# EAGLE design Yombonet (EAGLE 7.1.0)
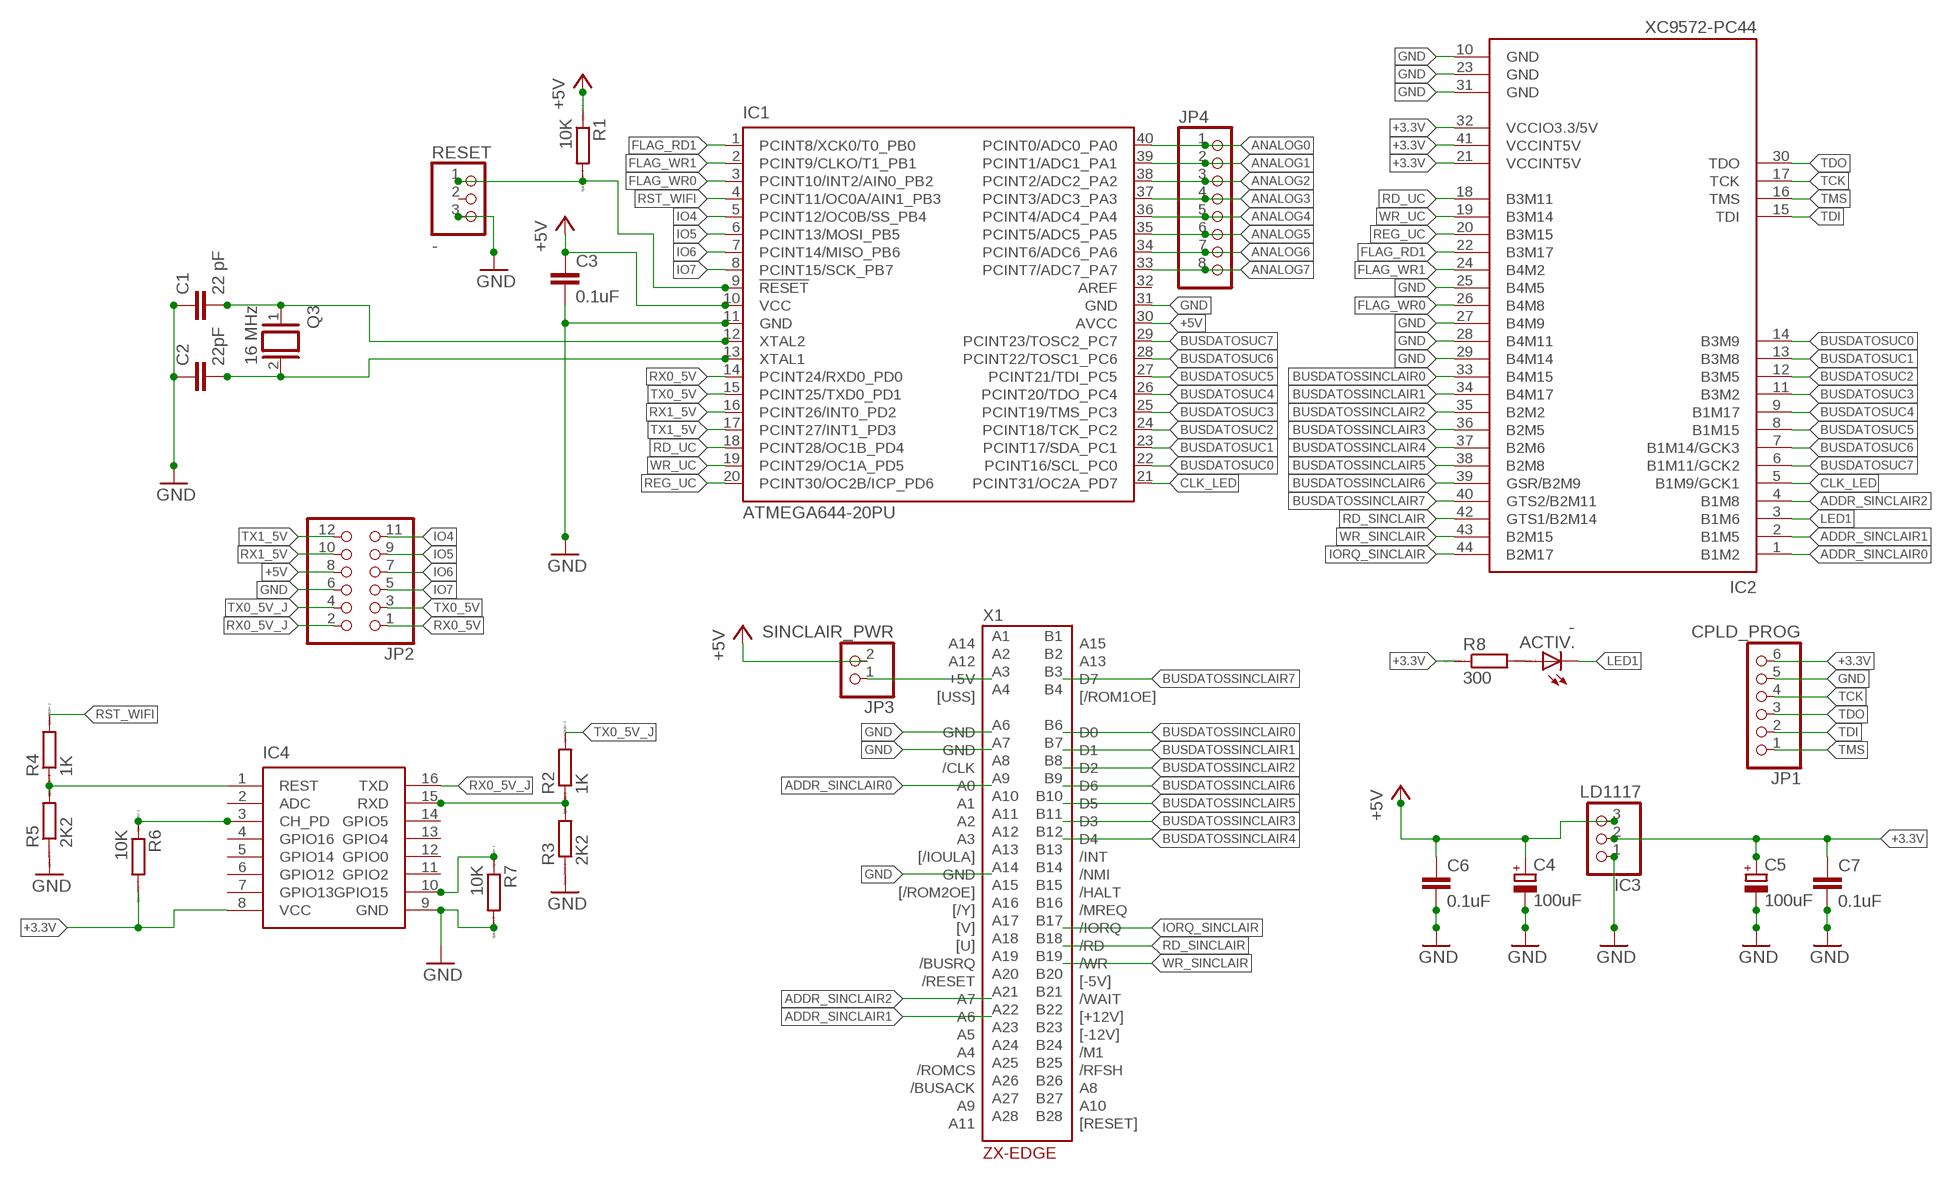
[diagram p0: schematic, sheet 1]

## Parts
ACTIV.  -  LED3MM  [LED3MM]
C1  22 pF  C-EU025-024X044  [C025-024X044]
C2  22pF  C-EU025-024X044  [C025-024X044]
C3  0.1uF  C-EU025-025X050  [C025-025X050]
C4  100uF  CPOL-EUE2.5-7  [E2,5-7]
C5  100uF  CPOL-EUE2.5-7  [E2,5-7]
C6  0.1uF  C-EU025-025X050  [C025-025X050]
C7  0.1uF  C-EU025-025X050  [C025-025X050]
IC1  ATMEGA644-20PU  [DIL40]
IC2  XC9572-PC44  [PLCC-S44]
IC3  LD1117  PINHD-1X3  [1X03]
IC4  ESP-07ESP-07  [ESP-07]
JP1  CPLD_PROG  PINHD-1X6  [1X06]
JP2  PINHD-2X6  [2X06]
JP3  SINCLAIR_PWR  PINHD-1X2  [1X02]
JP4  PINHD-1X8  [1X08]
Q3  16 MHz  XTAL/S  [QS]
R1  10K  R-EU_0207_10  [0207/10]
R2  1K  R-EU_0207_10  [0207/10]
R3  2K2  R-EU_0207_10  [0207/10]
R4  1K  R-EU_0207_10  [0207/10]
R5  2K2  R-EU_0207_10  [0207/10]
R6  10K  R-EU_0207_10  [0207/10]
R7  10K  R-EU_0207_10  [0207/10]
R8  300  R-EU_0207_10  [0207/10]
RESET  -  PINHD-1X3  [1X03]
X1  ZX-EDGE  [ZX-IFACE]

## Nets
+3.3V [power]: C5.+ C7.1 IC2.21(VCCINT5V) IC2.32(VCCIO3.3/5V) IC2.41(VCCINT5V) IC3.2 IC4.8(VCC) JP1.6 R6.2 R8.1
+5V [power]: C3.1 C4.+ C6.1 IC1.10(VCC) IC1.30(AVCC) IC3.3 JP2.8 JP3.2 R1.1
ADDR_SINCLAIR0: IC2.1(B1M2) X1.A9(A0)
ADDR_SINCLAIR1: IC2.2(B1M5) X1.A22(A6)
ADDR_SINCLAIR2: IC2.4(B1M8) X1.A21(A7)
ANALOG0: IC1.40(PCINT0/ADC0_PA0) JP4.1
ANALOG1: IC1.39(PCINT1/ADC1_PA1) JP4.2
ANALOG2: IC1.38(PCINT2/ADC2_PA2) JP4.3
ANALOG3: IC1.37(PCINT3/ADC3_PA3) JP4.4
ANALOG4: IC1.36(PCINT4/ADC4_PA4) JP4.5
ANALOG5: IC1.35(PCINT5/ADC5_PA5) JP4.6
ANALOG6: IC1.34(PCINT6/ADC6_PA6) JP4.7
ANALOG7: IC1.33(PCINT7/ADC7_PA7) JP4.8
BUSDATOSSINCLAIR0: IC2.33(B4M15) X1.B6(D0)
BUSDATOSSINCLAIR1: IC2.34(B4M17) X1.B7(D1)
BUSDATOSSINCLAIR2: IC2.35(B2M2) X1.B8(D2)
BUSDATOSSINCLAIR3: IC2.36(B2M5) X1.B11(D3)
BUSDATOSSINCLAIR4: IC2.37(B2M6) X1.B12(D4)
BUSDATOSSINCLAIR5: IC2.38(B2M8) X1.B10(D5)
BUSDATOSSINCLAIR6: IC2.39(GSR/B2M9) X1.B9(D6)
BUSDATOSSINCLAIR7: IC2.40(GTS2/B2M11) X1.B3(D7)
BUSDATOSUC0: IC1.22(PCINT16/SCL_PC0) IC2.14(B3M9)
BUSDATOSUC1: IC1.23(PCINT17/SDA_PC1) IC2.13(B3M8)
BUSDATOSUC2: IC1.24(PCINT18/TCK_PC2) IC2.12(B3M5)
BUSDATOSUC3: IC1.25(PCINT19/TMS_PC3) IC2.11(B3M2)
BUSDATOSUC4: IC1.26(PCINT20/TDO_PC4) IC2.9(B1M17)
BUSDATOSUC5: IC1.27(PCINT21/TDI_PC5) IC2.8(B1M15)
BUSDATOSUC6: IC1.28(PCINT22/TOSC1_PC6) IC2.7(B1M14/GCK3)
BUSDATOSUC7: IC1.29(PCINT23/TOSC2_PC7) IC2.6(B1M11/GCK2)
CH_PH_PULLUP: IC4.3(CH_PD) R6.1
CLK_LED: IC1.21(PCINT31/OC2A_PD7) IC2.5(B1M9/GCK1)
FLAG_RD1: IC1.1(PCINT8/XCK0/T0_PB0) IC2.22(B3M17)
FLAG_WR0: IC1.3(PCINT10/INT2/AIN0_PB2) IC2.26(B4M8)
FLAG_WR1: IC1.2(PCINT9/CLKO/T1_PB1) IC2.24(B4M2)
GND [ground]: C1.1 C2.1 C3.2 C4.- C5.- C6.2 C7.2 IC1.11(GND) IC1.31(GND) IC2.10(GND) IC2.23(GND) IC2.25(B4M5) IC2.27(B4M9) IC2.28(B4M11) IC2.29(B4M14) IC2.31(GND) IC3.1 IC4.9(GND) JP1.5 JP2.6 R3.1 R5.1 R7.2 RESET.3 X1.A6(GND) X1.A7(GND) X1.A14(GND)
GPIO15_PULLDOWN: IC4.10(GPIO15) R7.1
IO4: IC1.5(PCINT12/OC0B/SS_PB4) JP2.11
IO5: IC1.6(PCINT13/MOSI_PB5) JP2.9
IO6: IC1.7(PCINT14/MISO_PB6) JP2.7
IO7: IC1.8(PCINT15/SCK_PB7) JP2.5
IORQ_SINCLAIR: IC2.44(B2M17) X1.B17(/IORQ)
LED1: ACTIV..K(C) IC2.3(B1M6)
N$1: IC4.15(RXD) R2.1 R3.2
N$2 [ground]: ACTIV..A R8.2
N$3 [power]: JP3.1 X1.A3(+5V)
OSC1: C1.2 IC1.12(XTAL2) Q3.1
OSC2: C2.2 IC1.13(XTAL1) Q3.2
RD_SINCLAIR: IC2.42(GTS1/B2M14) X1.B18(/RD)
RD_UC: IC1.18(PCINT28/OC1B_PD4) IC2.18(B3M11)
REG_UC: IC1.20(PCINT30/OC2B/ICP_PD6) IC2.20(B3M15)
RESET_UC: IC1.9(!RESET) R1.2 RESET.1
RST_WIFI: IC1.4(PCINT11/OC0A/AIN1_PB3) R4.2
RST_WIFI_3.3V: IC4.1(REST) R4.1 R5.2
RX0_5V: IC1.14(PCINT24/RXD0_PD0) JP2.1
RX0_5V_J: IC4.16(TXD) JP2.2
RX1_5V: IC1.16(PCINT26/INT0_PD2) JP2.10
TCK: IC2.17(TCK) JP1.4
TDI: IC2.15(TDI) JP1.2
TDO: IC2.30(TDO) JP1.3
TMS: IC2.16(TMS) JP1.1
TX0_5V: IC1.15(PCINT25/TXD0_PD1) JP2.3
TX0_5V_J: JP2.4 R2.2
TX1_5V: IC1.17(PCINT27/INT1_PD3) JP2.12
WR_SINCLAIR: IC2.43(B2M15) X1.B19(/WR)
WR_UC: IC1.19(PCINT29/OC1A_PD5) IC2.19(B3M14)
Unconnected: IC1.32(AREF) IC4.2(ADC) IC4.4(GPIO16) IC4.5(GPIO14) IC4.6(GPIO12) IC4.7(GPIO13) IC4.11(GPIO2) IC4.12(GPIO0) IC4.13(GPIO4) IC4.14(GPIO5) RESET.2 X1.A1(A14) X1.A2(A12) X1.A4([USS]) X1.A8(/CLK) X1.A10(A1) X1.A11(A2) X1.A12(A3) X1.A13([/IOULA]) X1.A15([/ROM2OE]) X1.A16([/Y]) X1.A17([V]) X1.A18([U]) X1.A19(/BUSRQ) X1.A20(/RESET) X1.A23(A5) X1.A24(A4) X1.A25(/ROMCS) X1.A26(/BUSACK) X1.A27(A9) X1.A28(A11) X1.B1(A15) X1.B2(A13) X1.B4([/ROM1OE]) X1.B13(/INT) X1.B14(/NMI) X1.B15(/HALT) X1.B16(/MREQ) X1.B20([-5V]) X1.B21(/WAIT) X1.B22([+12V]) X1.B23([-12V]) X1.B24(/M1) X1.B25(/RFSH) X1.B26(A8) X1.B27(A10) X1.B28([RESET])

## Library data of the parts
ACTIV. = led:LED: LED OSRAM: - CHIPLED LG R971, LG N971, LY N971, LG Q971, LY Q971, LO R971, LY R971 LH N974, LH R974 LS Q976, LO Q976, LY Q976 LO Q996 - Hyper CHIPLED LW Q18S LB Q993, LB Q99A, LB R99A - SideLED LS A670, LO A670, LY A670, LG A670, LP A670 LB A673, LV A673, LT A673, LW A673 LH A674 LY A675 LS A676, LA A676, LO A676, LY A676, LW A676 LS A679, LY A679, LG A679 - Hyper Micro SIDELED� LS Y876, LA Y876, LO Y876, LY Y876 LT Y87S - SmartLED LW L88C, LW L88S LB L89C, LB L89S, LG L890 LS L89K, LO L89K, LY L89K LS L896, LA L896, LO L896, LY L896 - TOPLED LS T670, LO T670, LY T670, LG T670, LP T670 LSG T670, LSP T670, LSY T670, LOP T670, LYG T670 LG T671, LOG T671, LSG T671 LB T673, LV T673, LT T673, LW T673 LH T674 LS T676, LA T676, LO T676, LY T676, LB T676, LH T676, LSB T676, LW T676 LB T67C, LV T67C, LT T67C, LS T67K, LO T67K, LY T67K, LW E67C LS E67B, LA E67B, LO E67B, LY E67B, LB E67C, LV E67C, LT E67C LW T67C LS T679, LY T679, LG T679 LS T770, LO T770, LY T770, LG T770, LP T770 LB T773, LV T773, LT T773, LW T773 LH T774 LS E675, LA E675, LY E675, LS T675 LS T776, LA T776, LO T776, LY T776, LB T776 LHGB T686 LT T68C, LB T68C - Hyper Mini TOPLED� LB M676 - Mini TOPLED Santana� LG M470 LS M47K, LO M47K, LY M47K Source: http://www.osram.convergy.de LUXEON: - LUMILED� LXK2-PW12-R00, LXK2-PW12-S00, LXK2-PW14-U00, LXK2-PW14-V00 LXK2-PM12-R00, LXK2-PM12-S00, LXK2-PM14-U00 LXK2-PE12-Q00, LXK2-PE12-R00, LXK2-PE12-S00, LXK2-PE14-T00, LXK2-PE14-U00 LXK2-PB12-K00, LXK2-PB12-L00, LXK2-PB12-M00, LXK2-PB14-N00, LXK2-PB14-P00, LXK2-PB14-Q00 LXK2-PR12-L00, LXK2-PR12-M00, LXK2-PR14-Q00, LXK2-PR14-R00 LXK2-PD12-Q00, LXK2-PD12-R00, LXK2-PD12-S00 LXK2-PH12-R00, LXK2-PH12-S00 LXK2-PL12-P00, LXK2-PL12-Q00, LXK2-PL12-R00 Source: www.luxeon.com KINGBRIGHT: KA-3528ASYC Source: www.kingbright.com
C1-C3 C6 C7 = rcl:C-EU: CAPACITOR, European symbol
C4 C5 = rcl:CPOL-EU: POLARIZED CAPACITOR, European symbol
IC1 = atmel:ATMEGA644-*PU: 8-bit Microcontroller with 64K Bytes In-System Programmable Flash Auto generated by make-symbol-device-package-bsdl.ulp Rev. 34 Source: http://www.atmel.com/dyn/resources/prod_documents/doc2593.pdf; MPN: ATMEGA644-20PU; OC_FARNELL: 1288340; OC_NEWARK: 23M5060
IC2 = eOscope:XC9572-PC44
IC3 RESET = pinhead:PINHD-1X3: PIN HEADER
IC4 = Esp-07:ESP-07: Esp-07 ESP8266 WiFi module
JP1 = pinhead:PINHD-1X6: PIN HEADER
JP2 = pinhead:PINHD-2X6: PIN HEADER
JP3 = pinhead:PINHD-1X2: PIN HEADER
JP4 = pinhead:PINHD-1X8: PIN HEADER
Q3 = special:XTAL/S: CRYSTAL
R1-R8 = resistor:R-EU_: RESISTOR, European symbol; SPICEPREFIX: R
X1 = yabus:ZX-EDGE: Opposite part for ZX-Spectrum system bus

## Net classes
0 default: width 0.203 mm
1 ground: width 0.254 mm
2 power: width 0.406 mm

## Board
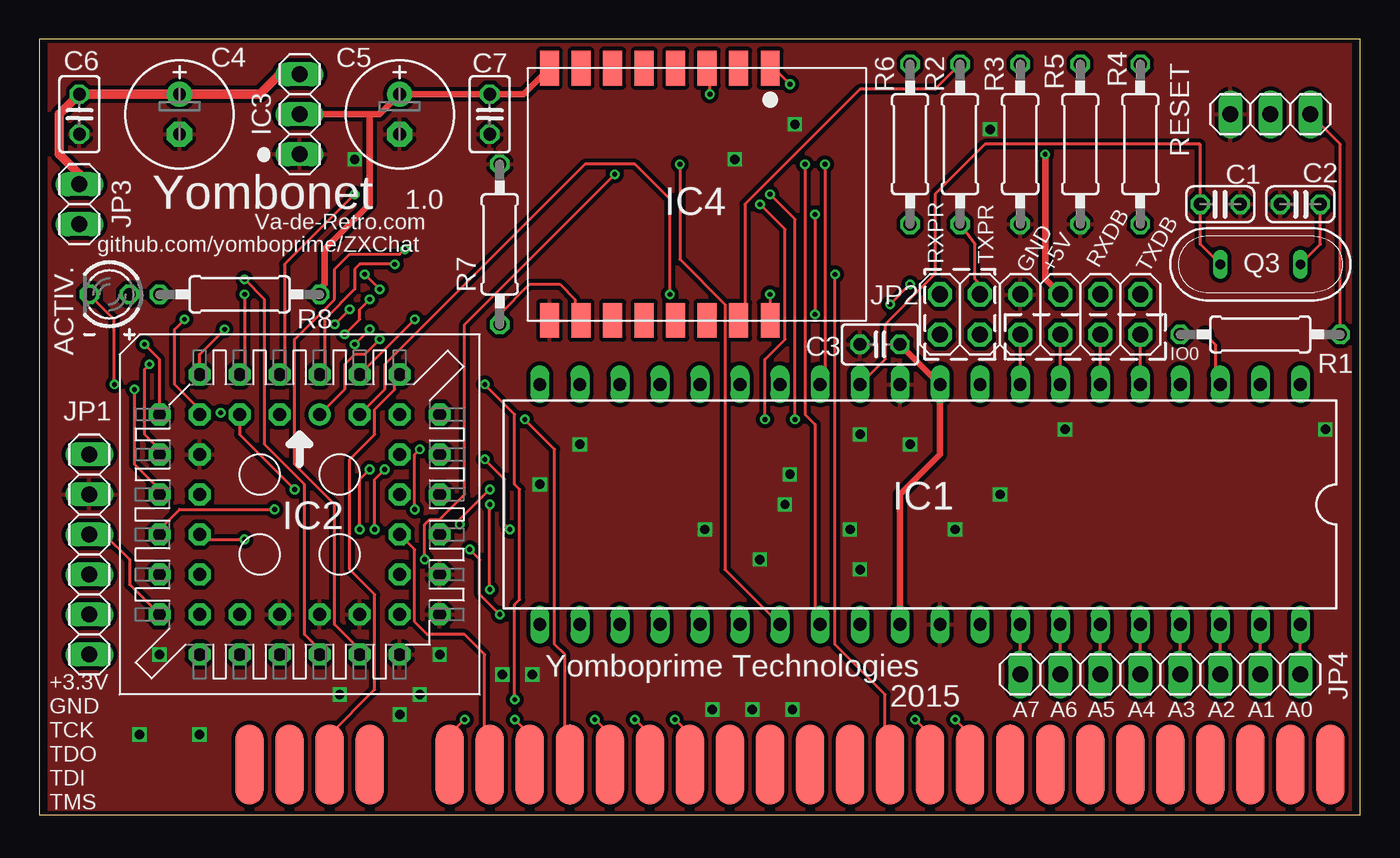
[diagram p1: board, top side]
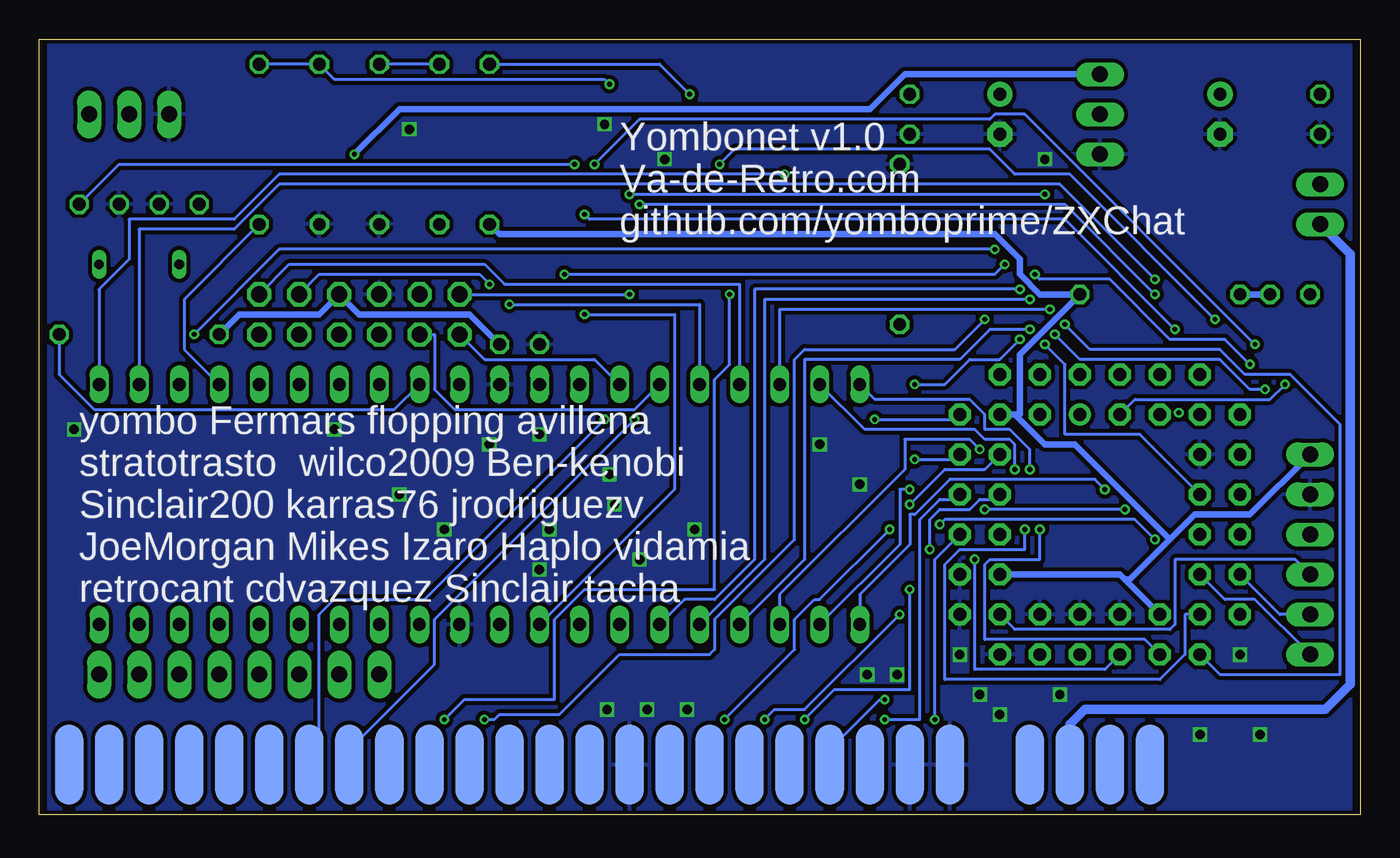
[diagram p2: board, bottom side, seen from below]

Size 83.8 x 49.2 mm. Coordinates in mm from the lower left corner, seen from the top.
Outline: 0,0 83.8,0 83.8,49.2 0,49.2 0,0
Copper layers (1*2*15*16): Top 0.035mm / dielectric 0.2mm / Route2 0.0175mm / dielectric 1.1mm / Route15 0.0175mm / dielectric 0.2mm / Bottom 0.035mm
Design rules "SeeedStudio_DRU_no_angle_20130527": minimum track width 6mil, minimum drill 12mil, track to track 6mil, track to pad 6mil, pad to pad 6mil, via to via 6mil, smd to smd 0mil, copper to edge 10mil, drill to drill 10mil, minimum pad ring 6mil, minimum via ring 6mil, stop-mask expansion 2mil, vias tented up to drill 25mil, thermal gap 10mil

### Footprints (pad centres in the part's own frame; a part is rotated, then mirrored left to right if it is on the bottom)
LED3MM = drill 0.813 octagon: A -1.27,0; K 1.27,0
C025-024X044 = drill 0.813 octagon: 1 -1.27,0; 2 1.27,0
C025-025X050 = drill 0.813 octagon: 1 -1.27,0; 2 1.27,0
E2,5-7 = drill 0.813 pad 1.6: + -1.27,0 | drill 0.813 pad 1.6 octagon: - 1.27,0
DIL40 = drill 0.813 long: 1 -24.13,-7.62; 2 -21.59,-7.62; 3 -19.05,-7.62; 4 -16.51,-7.62; 5 -13.97,-7.62; 6 -11.43,-7.62; 7 -8.89,-7.62; 8 -6.35,-7.62; 9 -3.81,-7.62; 10 -1.27,-7.62; 11 1.27,-7.62; 12 3.81,-7.62; 13 6.35,-7.62; 14 8.89,-7.62; 15 11.43,-7.62; 16 13.97,-7.62; 17 16.51,-7.62; 18 19.05,-7.62; 19 21.59,-7.62; 20 24.13,-7.62; 21 24.13,7.62; 22 21.59,7.62; 23 19.05,7.62; 24 16.51,7.62; 25 13.97,7.62; 26 11.43,7.62; 27 8.89,7.62; 28 6.35,7.62; 29 3.81,7.62; 30 1.27,7.62; 31 -1.27,7.62; 32 -3.81,7.62; 33 -6.35,7.62; 34 -8.89,7.62; 35 -11.43,7.62; 36 -13.97,7.62; 37 -16.51,7.62; 38 -19.05,7.62; 39 -21.59,7.62; 40 -24.13,7.62
PLCC-S44 = drill 0.813 pad 1.397: 1 1.27,6.35 | drill 0.813 pad 1.397 octagon: 2 -1.27,8.89; 3 -1.27,6.35; 4 -3.81,8.89; 5 -3.81,6.35; 6 -6.35,8.89; 7 -8.89,6.35; 8 -6.35,6.35; 9 -8.89,3.81; 10 -6.35,3.81; 11 -8.89,1.27; 12 -6.35,1.27; 13 -8.89,-1.27; 14 -6.35,-1.27; 15 -8.89,-3.81; 16 -6.35,-3.81; 17 -8.89,-6.35; 18 -6.35,-8.89; 19 -6.35,-6.35; 20 -3.81,-8.89; 21 -3.81,-6.35; 22 -1.27,-8.89; 23 -1.27,-6.35; 24 1.27,-8.89; 25 1.27,-6.35; 26 3.81,-8.89; 27 3.81,-6.35; 28 6.35,-8.89; 29 8.89,-6.35; 30 6.35,-6.35; 31 8.89,-3.81; 32 6.35,-3.81; 33 8.89,-1.27; 34 6.35,-1.27; 35 8.89,1.27; 36 6.35,1.27; 37 8.89,3.81; 38 6.35,3.81; 39 8.89,6.35; 40 6.35,8.89; 41 6.35,6.35; 42 3.81,8.89; 43 3.81,6.35; 44 1.27,8.89
1X03 = drill 1.016 long: 1 -2.54,0; 2 0,0; 3 2.54,0
ESP-07 = smd 2.2 x 1.2: 1 -8,7; 2 -8,5; 3 -8,3; 4 -8,1; 5 -8,-1; 6 -8,-3; 7 -8,-5; 8 -8,-7; 9 8,-7; 10 8,-5; 11 8,-3; 12 8,-1; 13 8,1; 14 8,3; 15 8,5; 16 8,7
1X06 = drill 1.016 long: 1 -6.35,0; 2 -3.81,0; 3 -1.27,0; 4 1.27,0; 5 3.81,0; 6 6.35,0
2X06 = drill 1.016 octagon: 1 -6.35,-1.27; 2 -6.35,1.27; 3 -3.81,-1.27; 4 -3.81,1.27; 5 -1.27,-1.27; 6 -1.27,1.27; 7 1.27,-1.27; 8 1.27,1.27; 9 3.81,-1.27; 10 3.81,1.27; 11 6.35,-1.27; 12 6.35,1.27
1X02 = drill 1.016 long: 1 -1.27,0; 2 1.27,0
1X08 = drill 1.016 long: 1 -8.89,0; 2 -6.35,0; 3 -3.81,0; 4 -1.27,0; 5 1.27,0; 6 3.81,0; 7 6.35,0; 8 8.89,0
QS = drill 0.61 long: 1 -2.54,0; 2 2.54,0
0207/10 = drill 0.813 octagon: 1 -5.08,0; 2 5.08,0
ZX-IFACE = smd 1.778 x 5.08 bottom: A1 0,0; A2 2.54,0; A3 5.08,0; A4 7.62,0; A6 12.7,0; A7 15.24,0; A8 17.78,0; A9 20.32,0; A10 22.86,0; A11 25.4,0; A12 27.94,0; A13 30.48,0; A14 33.02,0; A15 35.56,0; A16 38.1,0; A17 40.64,0; A18 43.18,0; A19 45.72,0; A20 48.26,0; A21 50.8,0; A22 53.34,0; A23 55.88,0; A24 58.42,0; A25 60.96,0; A26 63.5,0; A27 66.04,0; A28 68.58,0 | smd 1.778 x 5.08: B1 0,0; B2 2.54,0; B3 5.08,0; B4 7.62,0; B6 12.7,0; B7 15.24,0; B8 17.78,0; B9 20.32,0; B10 22.86,0; B11 25.4,0; B12 27.94,0; B13 30.48,0; B14 33.02,0; B15 35.56,0; B16 38.1,0; B17 40.64,0; B18 43.18,0; B19 45.72,0; B20 48.26,0; B21 50.8,0; B22 53.34,0; B23 55.88,0; B24 58.42,0; B25 60.96,0; B26 63.5,0; B27 66.04,0; B28 68.58,0

### Placement (x,y rotation side)
ACTIV.  4.45,33.02 180 top
C1  74.93,38.73 180 top
C2  80.01,38.73 0 top
C3  53.34,29.84 180 top
C4  8.89,44.45 270 top
C5  22.86,44.45 270 top
C6  2.54,44.45 270 top
C7  28.57,44.45 270 top
IC1  55.88,19.68 180 top
IC2  16.51,19.05 0 top
IC3  16.51,44.45 90 top
IC4  39.37,39.37 270 top
JP1  3.17,16.51 90 top
JP2  63.5,31.75 0 top
JP3  2.54,38.73 90 top
JP4  71.12,8.89 180 top
Q3  77.47,34.92 0 top
R1  77.47,30.48 0 top
R2  58.42,42.55 270 top
R3  62.23,42.55 90 top
R4  69.85,42.55 270 top
R5  66.04,42.55 90 top
R6  55.24,42.55 270 top
R7  29.21,36.2 90 top
R8  12.7,33.02 180 top
RESET  78.11,44.45 180 top
X1  13.34,3.17 0 top

### Tracks (layer width: path | path; a pad name or v marks a point on that pad's centre or on a via)
+3.3V
  Top 0.406: IC3.2 20.95,44.45 | 20.95,44.45 21.59,44.45 C5.+ C7.1 30.72,45.72 IC4.8 | 20.95,44.45 20.95,38.73 18.1,35.88 18.1,33.66 17.78,33.34 R8.1
  Bottom 0.406: 14.92,14.92 15.24,15.24 IC2.32 | 14.92,14.92 IC2.21 | JP1.6 6.99,19.05 10.48,19.05 12.06,17.46 | 12.06,17.46 14.61,14.92 14.92,14.92 | IC2.41 21.91,25.4 | 21.91,25.4 21.59,25.4 21.59,29.21 R8.1 20.32,33.02 21.59,34.29 21.59,35.24 23.18,36.83 54.61,36.83 R6.2 | 12.06,17.46 18.1,23.5 20,23.5 21.91,25.4
+5V  (via drill 0.3)
  Top 0.406: IC1.30 54.61,20.32 57.15,22.86 IC1.10 C3.1 | JP2.8 63.82,33.97 v63.82,41.91
  Top 0.61: IC3.3 15.24,46.99 13.97,45.72 C4.+ C6.1 1.27,44.45 1.27,41.91 2.54,40.64 JP3.2
  Bottom 0.406: R1.1 71.12,31.75 66.04,31.75 JP2.8 63.5,31.75 56.52,31.75 C3.1 | v63.82,41.91 60.96,44.77 31.11,44.77 28.89,46.99 IC3.3
ADDR_SINCLAIR0  (via drill 0.3)
  Top 0.203: IC2.1 19.37,26.99 19.37,28.57 20,29.21 20.64,29.21 v21.59,30.16 | v28.26,27.3 30.16,25.4 30.16,20.95 30.48,20.64 30.48,13.65 30.16,13.34 v30.16,7.3
  Bottom 0.203: v21.59,30.16 22.86,28.89 24.77,28.89 26.35,27.3 v28.26,27.3 | v30.16,7.3 30.48,7.3 33.66,4.13 X1.A9
ADDR_SINCLAIR1  (via drill 0.3)
  Top 0.203: IC2.2 15.56,28.26 15.56,34.92 v20,39.37 | v46.35,39.37 47.94,37.78 v47.94,25.08
  Bottom 0.203: v46.35,39.37 v20,39.37 | v47.94,25.08 59.37,13.65 65.09,13.65 66.04,12.7 66.04,3.17 X1.A22
ADDR_SINCLAIR2  (via drill 0.3)
  Top 0.203: IC2.4 13.02,28.26 v13.02,33.02 | v45.72,38.73 47.31,37.15 47.31,30.16 46.04,28.89 v46.04,25.08
  Bottom 0.203: v13.02,33.02 18.73,38.73 v45.72,38.73 | v46.04,25.08 58.74,12.38 58.74,9.53 64.14,4.13 X1.A21
ANALOG0
  Top 0.203: JP4.1 IC1.40
ANALOG1
  Top 0.203: JP4.2 IC1.39
ANALOG2
  Top 0.203: JP4.3 IC1.38
ANALOG3
  Top 0.203: JP4.4 IC1.37
ANALOG4
  Top 0.203: JP4.5 IC1.36
ANALOG5
  Top 0.203: JP4.6 IC1.35
ANALOG6
  Top 0.203: JP4.7 IC1.34
ANALOG7
  Top 0.203: JP4.8 IC1.33
BUSDATOSSINCLAIR0  (via drill 0.3)
  Top 0.203: v26.99,6.03 26.04,5.08 X1.B6
  Bottom 0.203: IC2.33 26.99,16.19 v26.99,6.03
BUSDATOSSINCLAIR1
  Top 0.203: IC2.34 23.81,16.83 23.81,12.22 24.61,11.43 26.99,11.43 28.26,10.16 28.26,3.49 X1.B7
BUSDATOSSINCLAIR2  (via drill 0.3)
  Top 0.203: v30.16,6.03 31.11,5.08 X1.B8
  Bottom 0.203: IC2.35 25.72,20 26.67,20 27.94,18.73 27.94,6.03 v30.16,6.03
BUSDATOSSINCLAIR3  (via drill 0.3)
  Top 0.203: v27.3,16.83 27.94,16.19 27.94,13.97 v29.21,12.7 | v37.78,6.03 38.73,5.08 X1.B11
  Bottom 0.203: IC2.36 23.18,20 24.13,20 24.77,19.37 26.67,19.37 27.3,18.73 v27.3,16.83 | v29.21,12.7 35.24,6.67 37.15,6.67 v37.78,6.03
BUSDATOSSINCLAIR4  (via drill 0.3)
  Top 0.203: v28.26,22.54 29.53,21.27 29.53,18.41 v29.84,18.1 | v40.32,6.03 41.27,5.08 X1.B12
  Bottom 0.203: IC2.37 25.72,22.54 v28.26,22.54 | v29.84,18.1 34.29,13.65 34.61,13.65 35.88,12.38 35.88,10.48 v40.32,6.03
BUSDATOSSINCLAIR5  (via drill 0.3)
  Top 0.203: v28.57,14.29 v28.57,19.68 | v35.24,6.03 36.2,5.08 X1.B10
  Bottom 0.203: IC2.38 23.81,21.91 26.35,21.91 v28.57,19.68 | v28.57,14.29 28.57,7.94 33.34,7.94 v35.24,6.03
BUSDATOSSINCLAIR6  (via drill 0.3)
  Top 0.203: v30.8,25.08 32.7,23.18 32.7,10.79 33.34,10.16 33.34,3.49 X1.B9
  Bottom 0.203: IC2.39 25.72,25.08 v30.8,25.08
BUSDATOSSINCLAIR7
  Top 0.203: IC2.40 22.54,27.62 22.54,26.99 21.27,25.72 21.27,24.13 19.68,22.54 19.68,15.56 21.27,13.97 21.27,7.94 18.41,5.08 X1.B3
BUSDATOSUC0  (via drill 0.3)
  Top 0.203: v28.57,20.64 26.67,18.73 v26.67,18.41 | v13.02,17.46 10.16,17.46 IC2.14
  Bottom 0.203: IC1.22 29.21,17.14 29.21,20.64 v28.57,20.64 | v26.67,18.41 26.35,18.73 14.29,18.73 v13.02,17.46
BUSDATOSUC1  (via drill 0.3)
  Top 0.203: v24.13,23.18 23.81,22.86 v23.81,19.37 | v14.92,19.37 8.89,19.37 7.62,18.1 IC2.13
  Bottom 0.203: IC1.23 36.83,13.97 28.89,21.91 28.89,23.81 24.77,23.81 v24.13,23.18 | v14.92,19.37 v23.81,19.37
BUSDATOSUC2  (via drill 0.3)
  Top 0.203: v20,29.84 v20.95,30.8
  Bottom 0.203: IC1.24 35.24,16.19 35.24,28.89 25.4,28.89 23.5,30.8 v20.95,30.8 | v20,29.84 18.73,28.57 18.73,24.13 13.97,24.13 IC2.12
BUSDATOSUC3  (via drill 0.3)
  Top 0.203: v20.95,32.7 20.32,32.07 20.32,31.43 v19.37,30.48 | v6.03,26.99 6.03,22.23 7.62,20.64 IC2.11
  Bottom 0.203: IC1.25 37.78,16.19 37.78,32.7 v20.95,32.7 | v19.37,30.48 17.78,28.89 8.89,28.89 6.99,26.99 v6.03,26.99
BUSDATOSUC4  (via drill 0.3)
  Top 0.203: v20.64,34.29 v21.59,33.34 | v6.99,28.57 6.67,28.26 6.67,24.13 7.62,23.18 IC2.9
  Bottom 0.203: IC1.26 42.86,13.65 40.96,13.65 38.42,16.19 38.42,33.34 v21.59,33.34 | v20.64,34.29 20.32,33.97 15.88,33.97 12.06,30.16 8.57,30.16 v6.99,28.57
BUSDATOSUC5  (via drill 0.3)
  Top 0.203: IC1.27 43.5,15.56 43.5,32.38 40.64,35.24 v40.64,41.27 | v9.21,31.43 8.57,30.8 8.57,27.3 10.16,25.72 IC2.8
  Bottom 0.203: v40.64,41.27 39.69,42.23 23.5,42.23 21.91,40.64 18.41,40.64 v9.21,31.43
BUSDATOSUC6  (via drill 0.3)
  Top 0.203: IC1.28 49.21,12.38 49.21,24.77 48.58,25.4 v48.58,41.27 | v6.67,29.84 7.62,28.89 IC2.7
  Bottom 0.203: v48.58,41.27 45.72,44.13 23.5,44.13 23.18,44.45 21.27,44.45 v6.67,29.84
BUSDATOSUC7  (via drill 0.3)
  Top 0.203: v49.21,38.1 v49.21,31.75 | v11.75,30.8 10.16,29.21 IC2.6
  Bottom 0.203: IC1.29 43.5,20.64 43.5,31.75 v49.21,31.75 | v49.21,38.1 48.9,37.78 18.73,37.78 v11.75,30.8
CH_PH_PULLUP  (via drill 0.3)
  Top 0.203: v42.55,45.72 42.55,47.31 IC4.3
  Bottom 0.203: v42.55,45.72 44.45,47.62 R6.1
CLK_LED  (via drill 0.3)
  Top 0.203: v16.19,20.64 12.7,24.13 IC2.5
  Bottom 0.203: IC1.21 31.75,13.97 28.57,17.14 28.57,19.05 28.26,19.05 26.04,21.27 16.83,21.27 v16.19,20.64
FLAG_RD1  (via drill 0.3)
  Top 0.203: v36.51,40.64 26.99,31.11 26.99,20.32 25.4,18.73 24.77,18.73 24.45,18.41 v24.45,16.19
  Bottom 0.203: IC1.1 80.01,33.34 78.11,35.24 78.11,37.78 71.44,37.78 68.58,40.64 v36.51,40.64 | v24.45,16.19 24.45,9.21 16.19,9.21 IC2.22
FLAG_WR0  (via drill 0.3)
  Top 0.203: IC1.3 74.61,27.62 74.61,29.84 v73.98,30.48 | v23.18,35.88 22.86,35.56 19.68,35.56 18.73,34.61 18.73,32.7 16.19,30.16 16.19,22.23 18.73,19.68 18.73,12.06 20.32,10.48 IC2.26
  Bottom 0.203: v73.98,30.48 68.58,35.88 v23.18,35.88
FLAG_WR1  (via drill 0.3)
  Top 0.203: v13.02,33.97 14.29,32.7 14.29,23.5 16.83,20.95 16.83,11.43 17.78,10.48 IC2.24
  Bottom 0.203: IC1.2 77.47,37.15 71.44,37.15 68.58,40.01 19.05,40.01 v13.02,33.97
GND  (via drill 0.6)
  other vias: 24.13,7.62 22.86,6.35 7.62,10.16 19.05,7.62 34.29,23.5 31.75,20.95 31.27,8.89 29.37,8.89 25.4,10.16 47.78,6.67 45.24,6.67 42.7,6.67 55.24,23.5 52.07,24.13 10.16,5.08 6.35,5.08 47.94,43.81 60.33,43.5 20,41.59 44.13,41.59 81.6,24.45 65.09,24.45 52.07,15.56 47.31,19.68 47.62,21.59 45.72,16.19 42.23,18.1 60.96,20.32 58.1,18.1 51.44,18.1
  pour Top (isolate 0.254): 0.64,0.32 83.19,0.32 83.19,48.9 0.64,48.9
  pour Bottom (isolate 0.254): 0.64,0.32 83.19,0.32 83.19,48.9 0.64,48.9
GPIO15_PULLDOWN
  Top 0.203: R7.1 29.21,31.75 31.11,33.66 33.02,33.66 33.97,32.7 33.97,31.75 34.29,31.43 IC4.10
IO4
  Top 0.203: IC1.5 JP2.11
IO5
  Top 0.203: IC1.6 JP2.9
IO6
  Top 0.203: IC1.7 JP2.7
IO7
  Top 0.203: IC1.8 JP2.5
IORQ_SINCLAIR  (via drill 0.3)
  Top 0.203: IC2.44 18.1,28.26 18.1,31.43 20,33.34 20,34.61 20.32,34.92 v22.54,34.92 | v50.48,34.29 50.48,10.79 53.66,7.62 53.66,3.49 X1.B17
  Bottom 0.203: v22.54,34.92 23.18,34.29 v50.48,34.29
LED1  (via drill 0.3)
  Top 0.203: ACTIV..K 4.76,31.43 v4.76,27.3
  Bottom 0.203: v4.76,27.3 5.71,26.35 14.29,26.35 IC2.3
N$1
  Top 0.203: R2.1 56.83,46.04 52.07,46.04 44.77,38.73 44.77,31.75 44.45,31.43 IC4.15
  Bottom 0.203: R2.1 R3.2
N$2
  Bottom 0.406: ACTIV..A R8.2
N$3
  Bottom 0.406: X1.A3 18.41,5.71
  Bottom 0.61: 18.41,5.71 17.46,6.67 2.22,6.67 0.64,8.26 0.64,35.56 JP3.1
N$4  (via drill 0.3)
  other vias: 11.5,25.5
OSC1
  Top 0.203: Q3.1 73.66,36.2 C1.2 73.66,42.55 60.01,42.55 56.83,39.37 56.83,34.29 53.66,31.11 53.66,28.89 IC1.12
OSC2  (via drill 0.3)
  Top 0.203: Q3.2 81.28,36.2 C2.2 | IC1.13 49.85,27.62 v49.85,41.27
  Bottom 0.203: v49.85,41.27 78.74,41.27 C2.2
RD_SINCLAIR  (via drill 0.3)
  Top 0.203: v23.81,31.43 IC2.42 | v55.56,6.03 56.52,5.08 X1.B18
  Bottom 0.203: v23.81,31.43 25.72,29.53 35.24,29.53 35.88,28.89 35.88,17.46 40.96,12.38 40.96,10.48 41.27,10.16 46.99,10.16 50.8,6.35 54.61,6.35 54.93,6.03 v55.56,6.03
RD_UC  (via drill 0.3)
  Top 0.203: v18.73,31.11 v19.68,32.07
  Bottom 0.203: IC1.18 36.83,32.07 v19.68,32.07 | v18.73,31.11 17.14,29.53 8.89,29.53 7.3,27.94 4.45,27.94 1.27,24.77 1.27,8.89 8.89,8.89 IC2.18
REG_UC  (via drill 0.3)
  Top 0.203: v20.95,21.91 20.32,21.27 v20.32,18.1
  Bottom 0.203: IC1.20 30.8,26.35 24.77,26.35 23.81,25.4 23.81,24.45 22.23,24.45 20.95,23.18 v20.95,21.91 | v20.32,18.1 20.32,16.19 23.5,16.19 23.81,15.88 23.81,11.11 13.65,11.11 IC2.20
RESET_UC
  Top 0.203: R1.2 82.55,42.55 RESET.1
  Bottom 0.203: IC1.9 61.28,25.72 80.33,25.72 82.55,27.94 R1.2
RST_WIFI
  Bottom 0.203: IC1.4 74.61,29.53 74.61,32.7 R4.2
RST_WIFI_3.3V  (via drill 0.3)
  Top 0.203: v47.62,46.35 46.67,47.31 IC4.1
  Bottom 0.203: v47.62,46.35 47.94,46.67 65.09,46.67 R5.2 R4.1
RX0_5V
  Bottom 0.203: IC1.14 48.58,28.89 55.56,28.89 JP2.1
RX0_5V_J  (via drill 0.3)
  Top 0.203: v46.35,33.02 46.35,31.43 IC4.16
  Bottom 0.203: JP2.2 v46.35,33.02
RX1_5V  (via drill 0.3)
  Top 0.203: v55.24,33.66 v53.98,32.38
  Bottom 0.203: IC1.16 41.91,32.38 v53.98,32.38 | v55.24,33.66 55.88,34.29 66.04,34.29 JP2.10
TCK
  Top 0.203: IC2.17 5.71,14.61 5.71,16.19 4.13,17.78 JP1.4
TDI
  Bottom 0.203: JP1.2 5.08,12.7 IC2.15
TDO
  Bottom 0.203: IC2.30 21.91,11.75 12.06,11.75 11.75,12.06 11.75,16.19 4.13,16.19 JP1.3
TMS
  Bottom 0.203: IC2.16 8.57,13.65 6.67,13.65 JP1.1
TX0_5V
  Bottom 0.203: IC1.15 46.04,25.72 57.47,25.72 58.74,26.99 58.74,30.48 JP2.3
TX0_5V_J
  Top 0.203: R2.2 59.37,36.2 59.37,33.97 59.69,33.66 JP2.4
TX1_5V
  Bottom 0.203: IC1.17 39.37,33.66 54.29,33.66 55.56,34.92 67.94,34.92 JP2.12
WR_SINCLAIR  (via drill 0.3)
  Top 0.203: IC2.43 21.91,26.99 21.91,28.57 34.61,41.27 37.78,41.27 40.01,39.05 v40.01,33.02 | v58.1,6.03 59.05,5.08 X1.B19
  Bottom 0.203: v40.01,33.02 40.01,28.57 40.96,27.62 40.96,14.29 49.21,14.29 51.12,12.38 51.12,7.3 56.83,7.3 v58.1,6.03
WR_UC  (via drill 0.3)
  Top 0.203: v21.91,21.91 21.27,21.27 v21.27,18.1
  Bottom 0.203: IC1.19 31.43,24.45 24.45,24.45 23.81,23.81 22.23,23.81 21.91,23.5 v21.91,21.91 | v21.27,18.1 21.27,16.83 25.4,16.83 26.35,15.88 26.35,8.57 12.7,8.57 11.11,10.16 11.11,12.7 IC2.19

### Text on the board
tPlace: Yombonet | 1.0 | Va-de-Retro.com | github.com/yomboprime/ZXChat | RXPR | TXPR | RXDB | GND | +5V | TXDB | IO0 | Yomboprime Technologies | 2015 | A7 | A6 | A5 | A4 | A3 | A2 | A1 | A0 | +3.3V / GND / TCK / TDO / TDI / TMS
bPlace: Yombonet v1.0 / Va-de-Retro.com / github.com/yomboprime/ZXChat | yombo Fermars flopping avillena / stratotrasto wilco2009 Ben-kenobi / Sinclair200 karras76 jrodriguezv / JoeMorgan Mikes Izaro Haplo vidamia / retrocant cdvazquez Sinclair tacha